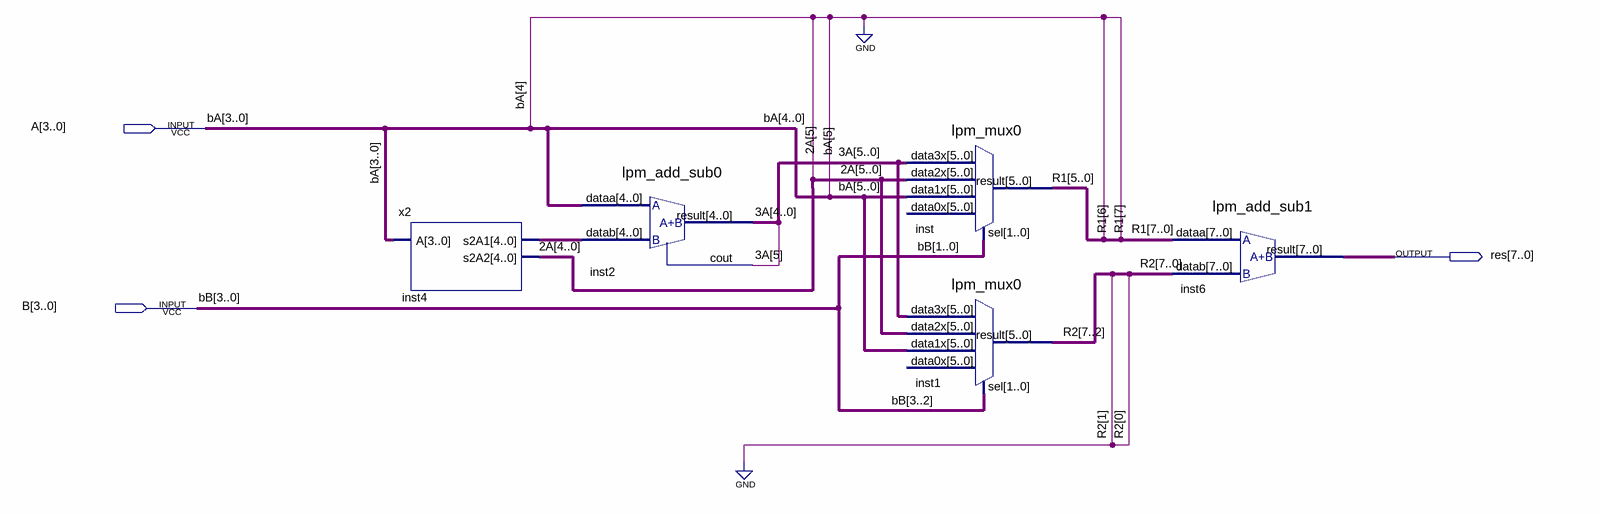
[diagram p0: schematic sheet]
// Quartus schematic scheme.bdf as structural Verilog: 5 symbols, 3 pins
module scheme (
  input  [3:0] A,
  input  [3:0] B,
  output [7:0] res
);

  wire [4:0] \2A , inst4_s2a1;
  wire [5:0] \3A , R1;
  wire [7:2] R2;

  x2 inst4 (.A(A), .s2A1(inst4_s2a1), .s2A2(\2A ));
  lpm_add_sub0 inst2 (.dataa({1'b0, A}), .datab(inst4_s2a1), .result(\3A [4:0]), .cout(\3A [5]));
  lpm_mux0 inst (.data3x(\3A ), .data2x({1'b0, \2A }), .data1x({2'b00, A}), .sel(B[1:0]), .result(R1));  // open: data0x
  lpm_mux0 inst1 (
    .data3x(\3A ), .data2x({1'b0, \2A }), .data1x({2'b00, A}), .sel(B[3:2]), .result(R2));  // open: data0x
  lpm_add_sub1 inst6 (.dataa({2'b00, R1}), .datab({R2, 2'b00}), .result(res));

  // Other names for the same wires on the sheet: bA[3:0] = A; bB[3:0] = B
endmodule
